# EAGLE design PecanPico5a (EAGLE 6.4)
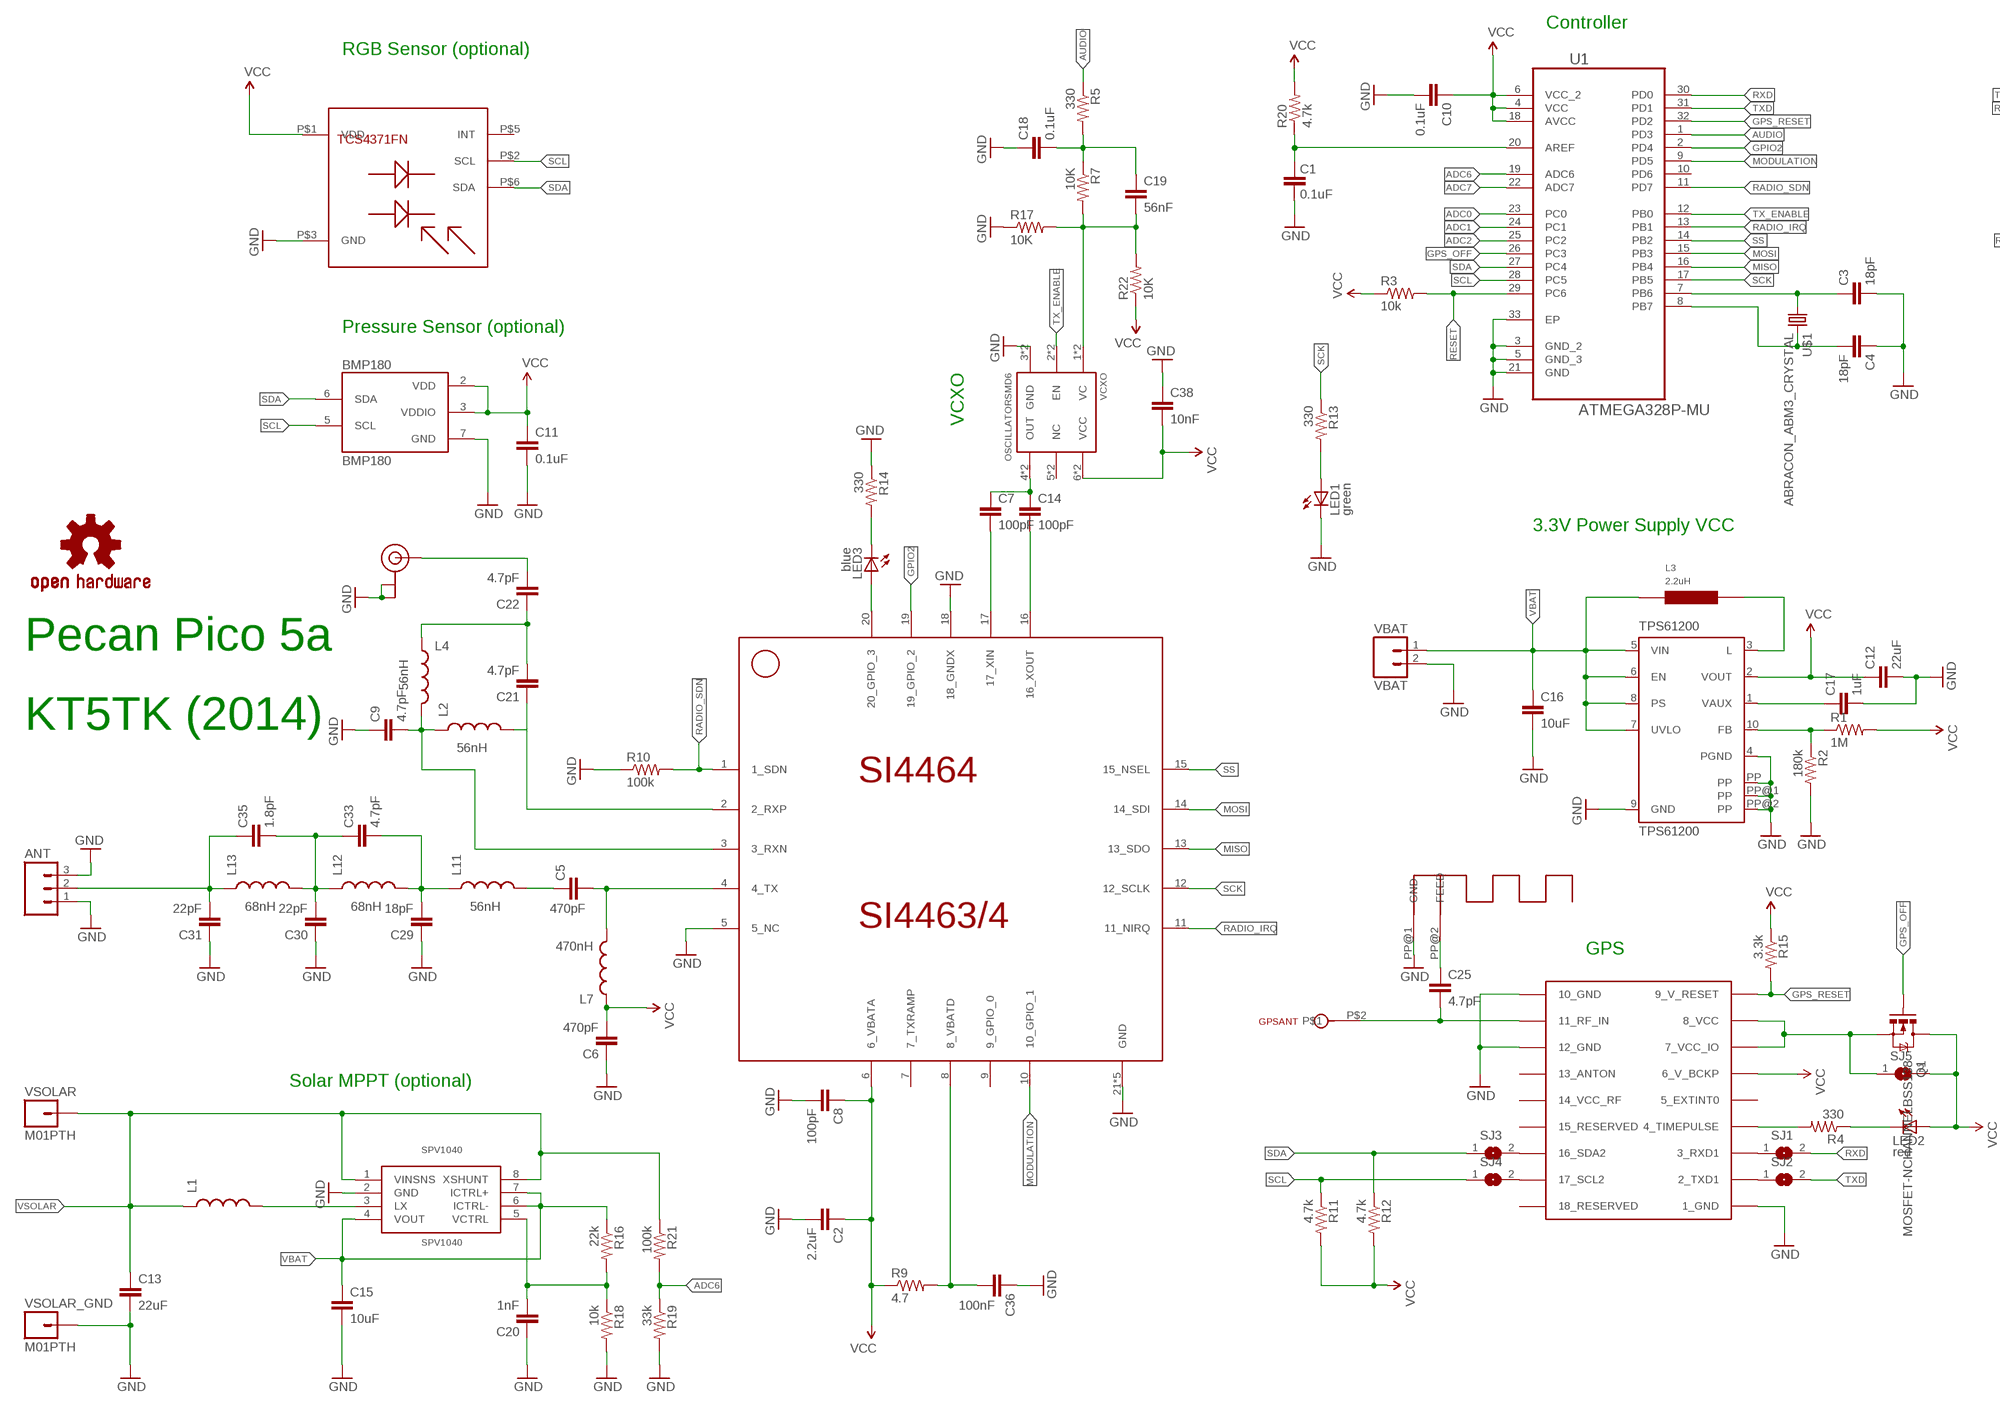
[diagram p0: schematic, sheet 1, part 1 of 2]
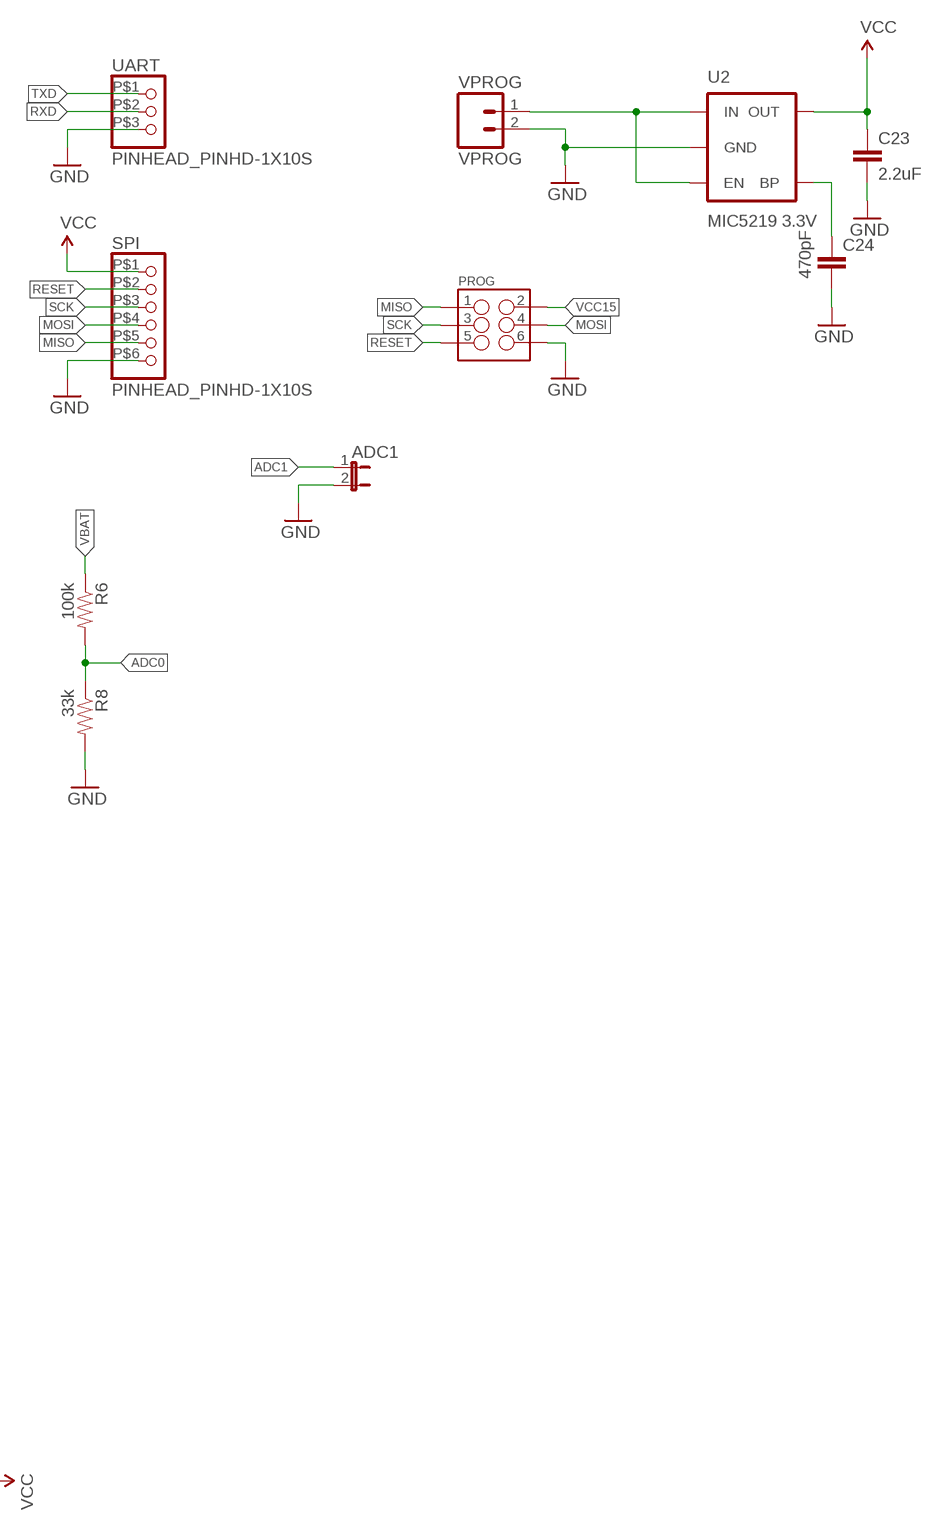
[diagram p1: schematic, sheet 1, part 2 of 2]

## Parts
ADC1  JUMPER-2SMD-NO-NS  [SJ_2S-NO-NS]
ANT  M03PTH  [1X03]
BMP180  BMP180  [BMP180]
C1  0.1uF  CAP0402-CAP  [0402-CAP]
C2  2.2uF  CAP0603-CAP  [0603-CAP]
C3  18pF  CAP0402-CAP  [0402-CAP]
C4  18pF  CAP0402-CAP  [0402-CAP]
C5  470pF  CAP0402-CAP  [0402-CAP]
C6  470pF  CAP0402-CAP  [0402-CAP]
C7  100pF  CAP0402-CAP  [0402-CAP]
C8  100pF  CAP0402-CAP  [0402-CAP]
C9  4.7pF  CAP0402-CAP  [0402-CAP]
C10  0.1uF  CAP0402-CAP  [0402-CAP]
C11  0.1uF  CAP0402-CAP  [0402-CAP]
C12  22uF  CAP0805  [0805]
C13  22uF  CAP0805  [0805]
C14  100pF  CAP0402-CAP  [0402-CAP]
C15  10uF  CAP0805  [0805]
C16  10uF  CAP0805  [0805]
C17  1uF  CAP0805  [0805]
C18  0.1uF  CAP0402-CAP  [0402-CAP]
C19  56nF  CAP0402-CAP  [0402-CAP]
C20  1nF  CAP0402-CAP  [0402-CAP]
C21  4.7pF  CAP0402-CAP  [0402-CAP]
C22  4.7pF  CAP0402-CAP  [0402-CAP]
C23  2.2uF  CAP0603-CAP  [0603-CAP]
C24  470pF  CAP0402-CAP  [0402-CAP]
C25  4.7pF  CAP0402-CAP  [0402-CAP]
C29  18pF  CAP0402-CAP  [0402-CAP]
C30  22pF  CAP0402-CAP  [0402-CAP]
C31  22pF  CAP0402-CAP  [0402-CAP]
C33  4.7pF  CAP0402-CAP  [0402-CAP]
C35  1.8pF  CAP0402-CAP  [0402-CAP]
C36  100nF  CAP0402-CAP  [0402-CAP]
C38  10nF  CAP0402-CAP  [0402-CAP]
GPSANT  1X1S  [1_27X1_PINHEAD_1X10S]
L1  SPARKFUN_INDUCTOR1007  [SPARKFUN_1007]
L2  56nH  INDUCTOR0603  [0603]
L3  2.2uH  LPS3015  [LPS3015]
L4  56nH  INDUCTOR0603  [0603]
L7  470nH  INDUCTOR0603  [0603]
L11  56nH  INDUCTOR0603  [0603]
L12  68nH  INDUCTOR0603  [0603]
L13  68nH  INDUCTOR0603  [0603]
LED1  green  LED0603  [LED-0603]
LED2  red  LED0603  [LED-0603]
LED3  blue  LED0603  [LED-0603]
LOGO1  OSHW-LOGOS  [OSHW-LOGO-S]
PROG  M03X22X3_SILK_SM  [2X3]
Q1  MOSFET-NCHANNELBSS138  [SOT23]
R1  1M  RESISTOR0402-RES  [0402-RES]
R2  180k  RESISTOR0402-RES  [0402-RES]
R3  10k  RESISTOR0402-RES  [0402-RES]
R4  330  RESISTOR0402-RES  [0402-RES]
R5  330  RESISTOR0402-RES  [0402-RES]
R6  100k  RESISTOR0402-RES  [0402-RES]
R7  10K  RESISTOR0402-RES  [0402-RES]
R8  33k  RESISTOR0402-RES  [0402-RES]
R9  4.7  RESISTOR0402-RES  [0402-RES]
R10  100k  RESISTOR0402-RES  [0402-RES]
R11  4.7k  RESISTOR0402-RES  [0402-RES]
R12  4.7k  RESISTOR0402-RES  [0402-RES]
R13  330  RESISTOR0402-RES  [0402-RES]
R14  330  RESISTOR0402-RES  [0402-RES]
R15  3.3k  RESISTOR0402-RES  [0402-RES]
R16  22k  RESISTOR0402-RES  [0402-RES]
R17  10K  RESISTOR0402-RES  [0402-RES]
R18  10k  RESISTOR0402-RES  [0402-RES]
R19  33k  RESISTOR0402-RES  [0402-RES]
R20  4.7k  RESISTOR0402-RES  [0402-RES]
R21  100k  RESISTOR0402-RES  [0402-RES]
R22  10K  RESISTOR0402-RES  [0402-RES]
SI4464  SI4463/4  [QFN-20]
SJ1  SJ  [SJ]
SJ2  SJ  [SJ]
SJ3  SJ  [SJ]
SJ4  SJ  [SJ]
SJ5  SJ  [SJ]
SPI  PINHEAD_PINHD-1X10S  [PINHEAD_1X10S]
SPV1040  SPV1040  [TSSOP8]
TCS4371FN  TCS4371FN  [TCS3471FN]
TPS61200  TPS61200  [S-PDSO-N10]
U1  ATMEGA328P-MU  [QFN50P500X500X100-33N]
U2  MIC5219 3.3V  V_REG_MIC52193.3V  [SOT23-5]
U$1  ABRACON_ABM3_CRYSTAL  [ABRACON_ABM3_CRYSTAL]
U$2  U.FL  [U.FL]
U$3  UBLOX_MAX-6  [UBLOX_MAX-6]
U$4  GPS_MEANDER  [GPS_INV_F_MEANDER]
UART  PINHEAD_PINHD-1X10S  [PINHEAD_1X10S]
VBAT  VBAT  M02PTH  [1X02]
VCXO  OSCILLATORSMD6  [CRYSTAL-SMD-7.5X5.2-6PIN]
VPROG  VPROG  M02PTH  [1X02]
VSOLAR  M01PTH  [1X01]
VSOLAR_GND  M01PTH  [1X01]

## Nets
ADC0: R6.2 R8.1 U1.23(PC0)
ADC1: ADC1.1 U1.24(PC1)
ADC2: U1.25(PC2)
ADC6: R19.1 R21.2 U1.19(ADC6)
ADC7: U1.22(ADC7)
AREF: C1.2 R20.1 U1.20(AREF)
AUDIO: R5.1 U1.1(PD3)
GND: ADC1.2 ANT.1 ANT.3 BMP180.7(GND) C1.1 C2.2 C3.2 C4.1 C6.1 C8.2 C9.1 C10.2 C11.2 C12.2 C13.2 C15.2 C16.2 C17.2 C18.1 C20.1 C23.2 C24.2 C29.1 C30.1 C31.1 C36.1 C38.1 LED1.C PROG.6 R2.2 R8.2 R10.1 R14.1 R17.1 R18.2 R19.2 SI4464.5(5_NC) SI4464.18(18_GNDX) SI4464.21(GND) SI4464.22(GND) SI4464.23(GND) SI4464.24(GND) SI4464.25(GND) SPI.P$6 SPV1040.2(GND) TCS4371FN.P$3(GND) TPS61200.4(PGND) TPS61200.9(GND) TPS61200.PP TPS61200.PP@1(PP) TPS61200.PP@2(PP) U1.3(GND_2) U1.5(GND_3) U1.21(GND) U1.33(EP) U2.2(GND) U$2.P$1(GND) U$2.P$2(GND) U$3.1_GND U$3.10_GND U$3.12_GND U$4.PP@1(GND) UART.P$3 VBAT.2 VCXO.3(GND) VCXO.3INNER(GND) VPROG.2 VSOLAR_GND.1
GPIO2: SI4464.19(19_GPIO_2) U1.2(PD4)
GPS_OFF: Q1.1(G) U1.26(PC3)
GPS_RESET: R15.2 U1.32(PD2) U$3.9_V_RESET
MISO: PROG.1 SI4464.13(13_SDO) SPI.P$5 U1.16(PB4)
MOD1: C18.2 C19.1 R5.2 R7.1
MODULATION: SI4464.10(10_GPIO_1) U1.9(PD5)
MOSI: PROG.4 SI4464.14(14_SDI) SPI.P$4 U1.15(PB3)
N$2: C14.2 SI4464.16(16_XOUT)
N$3: C25.2 GPSANT.P$2 U$3.11_RF_IN
N$4: L3.P$2 TPS61200.3(L)
N$5: R1.1 R2.1 TPS61200.10(FB)
N$6: LED2.C R4.1
N$7: C17.1 TPS61200.1(VAUX)
N$8: R4.2 U$3.4_TIMEPULSE
N$9: C3.1 U1.7(PB6) U$1.P$1
N$10: C4.2 U1.8(PB7) U$1.P$2
N$13: C7.1 C14.1 VCXO.4(OUT) VCXO.4INNER(OUT)
N$15: SJ1.1 U$3.3_RXD1
N$20: SJ2.1 U$3.2_TXD1
N$21: C19.2 R7.2 R17.2 R22.2 VCXO.1(VC) VCXO.1INNER(VC)
N$22: LED1.A R13.2
N$23: C5.2 L7.2 SI4464.4(4_TX)
N$24: C21.1 L2.2 SI4464.2(2_RXP)
N$25: SJ3.2 U$3.16_SDA2
N$26: SJ4.2 U$3.17_SCL2
N$27: C5.1 L11.2
N$28: C30.2 C33.1 C35.2 L12.1 L13.2
N$29: LED3.A SI4464.20(20_GPIO_3)
N$30: LED3.C R14.2
N$31: C7.2 SI4464.17(17_XIN)
N$32: L1.2 SPV1040.3(LX)
N$33: C9.2 L2.1 L4.2 SI4464.3(3_RXN)
N$34: C29.2 C33.2 L11.1 L12.2
N$35: ANT.2 C31.2 C35.1 L13.1
N$36: C20.2 R16.2 R18.1 SPV1040.5(VCTRL)
N$37: C21.2 C22.1 L4.1
N$38: Q1.2(S) SJ5.1 U$3.7_VCC_IO U$3.8_VCC
N$39: C22.2 U$2.P$3(SIGNAL)
N$40: U2.1(IN) U2.3(EN) VPROG.1
N$41: C36.2 R9.2 SI4464.8(8_VBATD)
N$42: C24.1 U2.4(BP)
N$43: C25.1 U$4.PP@2(FEED)
RADIO_IRQ: SI4464.11(11_NIRQ) U1.13(PB1)
RADIO_SDN: R10.2 SI4464.1(1_SDN) U1.11(PD7)
RESET: PROG.5 R3.2 SPI.P$2 U1.29(PC6)
RXD: SJ1.2 U1.30(PD0) UART.P$2
SCK: PROG.3 R13.1 SI4464.12(12_SCLK) SPI.P$3 U1.17(PB5)
SCL: BMP180.5(SCL) R11.1 SJ4.1 TCS4371FN.P$2(SCL) U1.28(PC5)
SDA: BMP180.6(SDA) R12.1 SJ3.1 TCS4371FN.P$6(SDA) U1.27(PC4)
SS: SI4464.15(15_NSEL) U1.14(PB2)
TX_ENABLE: U1.12(PB0) VCXO.2(EN) VCXO.2INNER(EN)
TXD: SJ2.2 U1.31(PD1) UART.P$1
VBAT [vcc]: C15.1 C16.1 L3.P$1 R6.1 R16.1 SPV1040.4(VOUT) SPV1040.6(ICTRL-) SPV1040.7(ICTRL+) TPS61200.5(VIN) TPS61200.6(EN) TPS61200.7(UVLO) TPS61200.8(PS) VBAT.1
VCC15: BMP180.2(VDD) BMP180.3(VDDIO) C2.1 C6.2 C8.1 C10.1 C11.1 C12.1 C23.1 C38.2 L7.1 LED2.A PROG.2 Q1.3(D) R1.2 R3.1 R9.1 R11.2 R12.2 R15.1 R20.2 R22.1 SI4464.6(6_VBATA) SJ5.2 SPI.P$1 TCS4371FN.P$1(VDD) TPS61200.2(VOUT) U1.4(VCC) U1.6(VCC_2) U1.18(AVCC) U2.5(OUT) U$3.6_V_BCKP VCXO.6(VCC) VCXO.6INNER(VCC) ; supply symbol labelled VCC
VSOLAR: C13.1 L1.1 R21.1 SPV1040.1(VINSNS) SPV1040.8(XSHUNT) VSOLAR.1
Unconnected: SI4464.7(7_TXRAMP) SI4464.9(9_GPIO_0) TCS4371FN.P$5(INT) U1.10(PD6) U$3.5_EXTINT0 U$3.13_ANTON U$3.14_VCC_RF U$3.15_RESERVED U$3.18_RESERVED VCXO.5(NC) VCXO.5INNER(NC)

## Notes on the sheet
- Controller
- RGB Sensor (optional)
- Pressure Sensor (optional)
- VCXO
- 3.3V Power Supply VCC
- Pecan Pico 5a
- KT5TK (2014)
- GPS
- Solar MPPT (optional)

## Library data of the parts
ADC1 = SparkFun-Passives:JUMPER-2: Jumper Basic 0.1" spaced jumper. Use with breakaway headers.
ANT = SparkFun-Connectors:M03: Header 3 Standard 3-pin 0.1" header. Use with straight break away headers (SKU : PRT-00116), right angle break away headers (PRT-00553), swiss pins (PRT-00743), machine pins (PRT-00117), and female headers (PRT-00115). Molex polarized connector foot print use with SKU : PRT-08232 with associated crimp pins and housings.
BMP180 = SparkFun-Sensors:BMP180: BOSCH BMP180 DIGITAL BAROMETRIC PRESSURE SENSOR Web page: http://www.bosch-sensortec.com/en/homepage/products_3/environmental_sensors_1/bmp180_1/bmp180 Datasheet: http://ae-bst.resource.bosch.com/media/products/dokumente/bmp180/BST-BMP180-DS000-09.pdf The BMP180 is the function compatible successor of the BMP085, a new generation of high precision digital pressure sensors for consumer applications. The ultra-low power, low voltage electronics of the BMP180 is optimized for use in mobile phones, PDAs, GPS navigation devices and outdoor equipment. With a low altitude noise of merely 0.25m at fast conversion time, the BMP180 offers superior performance. The I2C interface allows for easy system integration with a microcontroller. The BMP180 is based on piezo-resistive technology for EMC robustness, high accuracy and linearity as well as long term stability. Key features: - Temperature measurement included - I2C interface - Fully calibrated - Pb-free, halogen-free and RoHS compliant, - MSL 1 Basic specs: Pressure range: 300 to 1100hPa (+9000m to -500m relating to sea level) Supply voltage: 1.8 to 3.6V (VDD), 1.62V to 3.6V (VDDIO) Package: LGA package with metal lid Small footprint: 3.6mm x 3.8mm Super-flat: 0.93mm height Low power: 5μA at 1 sample / sec. in standard mode Low noise: 0.06hPa (0.5m) in ultra low power mode, 0.02hPa (0.17m) advanced resolution mode Typical applications: - Enhancement of GPS navigation (dead-reckoning, slope detection, etc.) - In- and out-door navigation - Leisure and sports - Weather forecast - Vertical velocity indication (rise/sink speed)
C1-C11 C14 C18-C25 C29-C31 C33 C35 C36 C38 = SparkFun:CAP: Capacitor Standard 0603 ceramic capacitor, and 0.1" leaded capacitor.
C12 C13 C15-C17 = SparkFun-Passives:CAP: Capacitor Standard 0603 ceramic capacitor, and 0.1" leaded capacitor.
GPSANT = PecanPico5a:1X1S
L1 = HabAmp.lbrHAMAmp2.1:SPARKFUN_INDUCTOR: Inductors Basic Inductor/Choke - 0603 and 1206. Footprints are not proven and vary greatly between part numbers.
L2 L4 L7 L11-L13 = SparkFun:INDUCTOR: Inductors Basic Inductor/Choke - 0603 and 1206. Footprints are not proven and vary greatly between part numbers.
L3 = inductor-coilcraft-TK:LPS3015: LPS3015 Series Low Profile Shielded Power Inductors http://www.coilcraft.com/lps3015.cfm <0.058>
LED1-LED3 = SparkFun:LED: LEDs Standard schematic elements and footprints for 5mm, 3mm, 1206, and 0603 sized LEDs. 5mm - Spark Fun Electronics SKU : COM-00529 (and others)
LOGO1 = SparkFun-Aesthetics:OSHW-LOGO: Open Source Hardware Logo This logo indicates the piece of hardware it is found on incorporates a OSHW license and/or adheres to the definition of open source hardware found here: http://freedomdefined.org/OSHW
PROG = SparkFun-Connectors:M03X2: 2x3 .1" header. Shrouded, with keying- CONN-10681 SMT- CONN-11415 Pogo pins- HW-11044
Q1 = SparkFun-DiscreteSemi:MOSFET-NCHANNEL: Common NMOSFET Parts MFG P/N Store ID Prod ID FDD8780 TRANS-09984 SI7820DN TRANS-11055 FDS6630A IC-08089 2N7002PW TRANS-11151 FQP30N06L COM-10213 TRANS-10060 BSS123LT1G TRANS-08345 BSS138 TRANS-00830 BS170 2N7000; PROD_ID: TRANS-00830
R1-R22 = SparkFun:RESISTOR: Resistor Basic schematic elements and footprints for 0603, 1206, and PTH resistors.
SI4464 = KT5TK:SI4463/4
SJ1-SJ5 = jumper:SJ: SMD solder JUMPER
SPI = 1_27x6:PINHEAD_PINHD-1X10S: Pinhad 1x10 smal
SPV1040 = SPV1040:SPV1040
TCS4371FN = KT5TK:TCS4371FN: TCS4371FN Color Sensor The TCS3471 family of devices provides red, green, blue, and clear light sensing (RGBC) that detects light intensity under a variety of lighting conditions and through a variety of attenuation materials. An internal state machine provides the ability to put the device into a low power mode in between RGBC measurements providing very low average power consumption. The TCS3471 is directly useful in lighting conditions containing minimal IR content such as LED RGB backlight control, reflected LED color sampler, or fluorescent light color temperature detector. With the addition of an IR blocking filter, the device is an excellent ambient light sensor, color temperature monitor, and general purpose color sensor.
TPS61200 = texas:TPS6120*: LOW INPUT VOLTAGE SYNCHRONOUS BOOST CONVERTER WITH 1.3-A SWITCHES Source: http://focus.ti.com/lit/ds/symlink/tps61200.pdf; MPN: TPS61200DRCT; OC_FARNELL: 1471238; OC_NEWARK: 37M0066
U1 = ava:ATMEGA328P-MU: Programmable Flash; MPN: ATMEGA328P-MU; OC_FARNELL: 1748522; OC_NEWARK: 26R2526; PACKAGE: QFN-32; SUPPLIER: Atmel
U2 = SparkFun-PowerIC:V_REG_MIC5219: V_REG MIC5219 Standard 500mA LDO voltage regulator in SOT-23 layout. Micrel part MIC5219. BP (by-pass) pin is used to lower output noise with 470pF cap, may be left open.; PROD_ID: VREG-09872
U$1 = ava:ABRACON_ABM3_CRYSTAL
U$2 = SparkFun-Connectors:U.FL: SMD antenna connector- WRL-09144
U$3 = ava:UBLOX_MAX-6: UBLOX MAX-6
U$4 = KT5TK:GPS_MEANDER
UART = 1_27x3:PINHEAD_PINHD-1X10S: Pinhad 1x10 smal
VBAT VPROG = SparkFun:M02: Header 2 Standard 2-pin 0.1" header. Use with straight break away headers (SKU : PRT-00116), right angle break away headers (PRT-00553), swiss pins (PRT-00743), machine pins (PRT-00117), and female headers (PRT-00115). Molex polarized connector foot print use with SKU : PRT-08233 with associated crimp pins and housings.
VCXO = SparkFun-FreqCtrl_TK:OSCILLATOR: Generic 5x3 and 7x5 oscillators
VSOLAR VSOLAR_GND = SparkFun-Connectors:M01: Header 1 Standard 1-pin 0.1" header. Use with straight break away headers (SKU : PRT-00116), right angle break away headers (PRT-00553), swiss pins (PRT-00743), machine pins (PRT-00117), and female headers (PRT-00115).

## Net classes
0 default: width 0.203 mm
1 vcc: width 0.254 mm

## Board
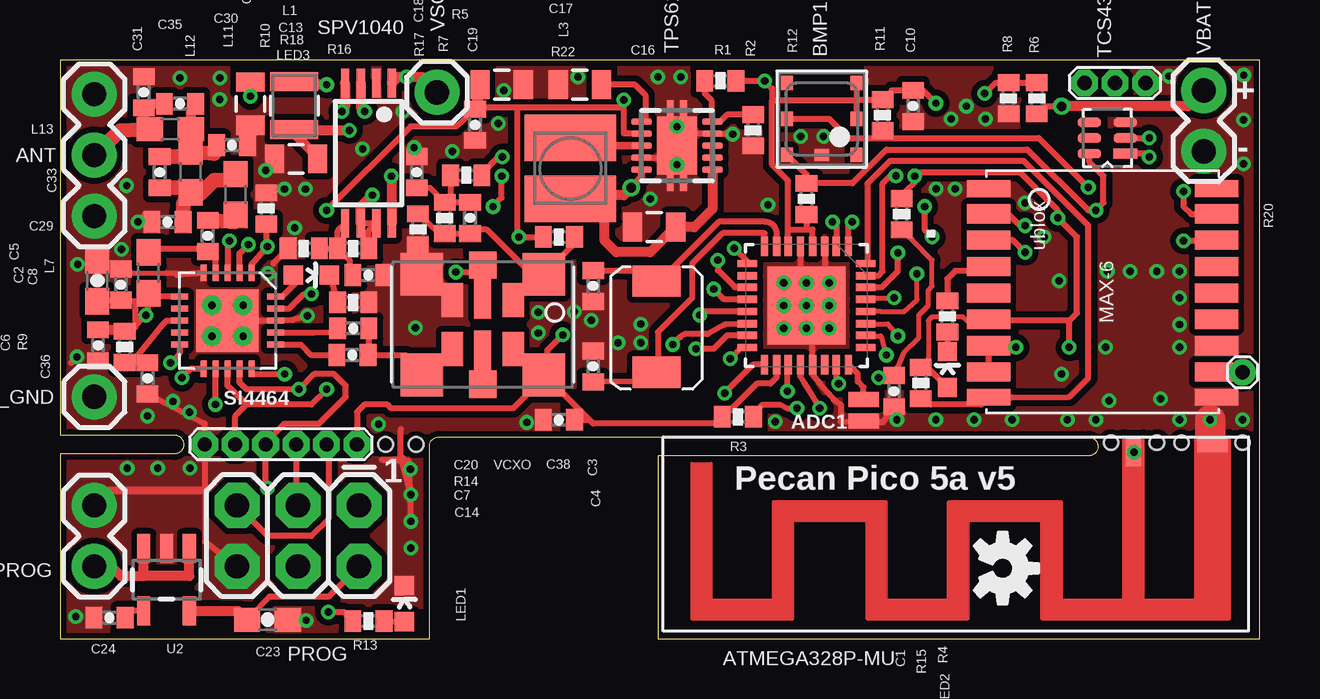
[diagram p2: board, top side]
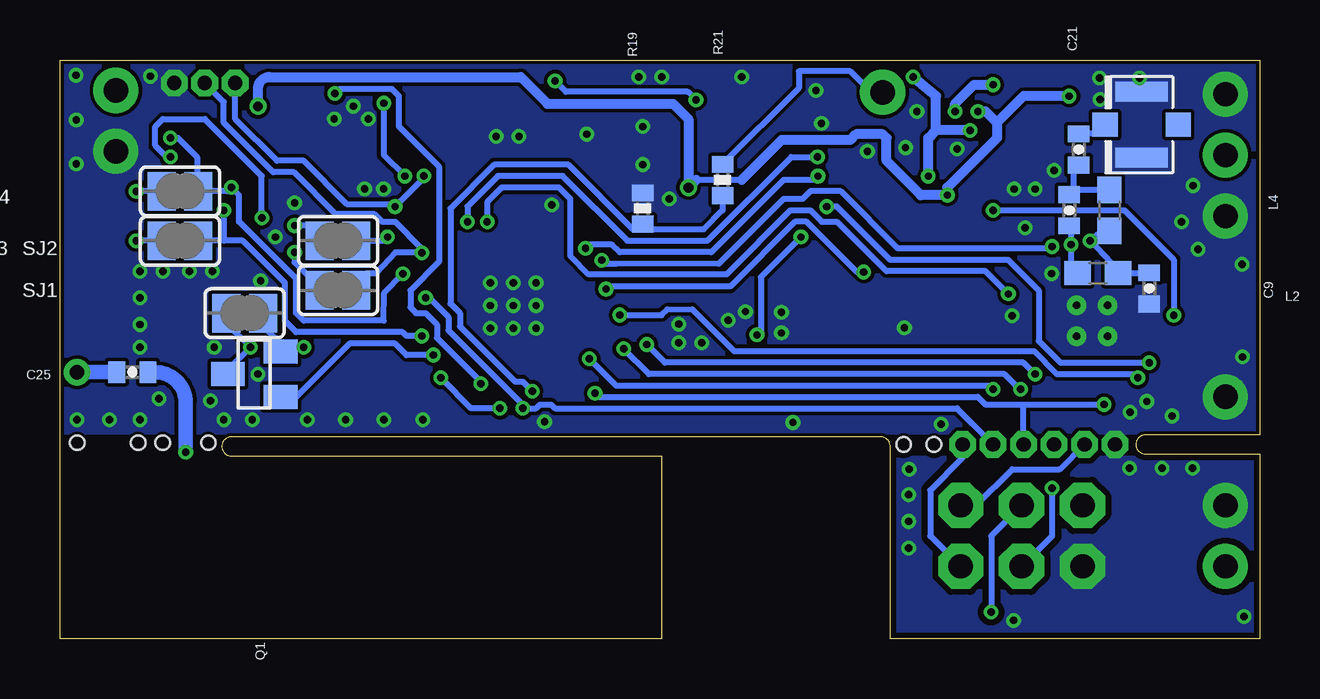
[diagram p3: board, bottom side, seen from below]

Size 50.01 x 24.13 mm. Coordinates in mm from the lower left corner, seen from the top.
Outline: 0,0 15.4,0 15.4,8.02 arc-90 15.8,8.41 42.86,8.41 arc-90 43.26,8.02 arc-100 42.78,7.62 24.92,7.62 24.92,0 50.01,0 50.01,24.13 0,24.13 0,8.49 4.76,8.49 arc-90 5.16,8.1 arc-90 4.76,7.7 0,7.7 0,0
Copper layers (1*16): Top 0.035mm / dielectric 1.5mm / Bottom 0.035mm
Design rules "hackvana *": minimum track width 6mil, minimum drill 0.3mm, track to track 6mil, track to pad 6mil, pad to pad 6mil, via to via 6mil, smd to smd 0mil, copper to edge 6mil, drill to drill 6mil, minimum pad ring 10mil, minimum via ring 6mil, stop-mask expansion 2mil, vias tented up to drill 100mil, thermal gap 10mil
Holes 0.6 mm at 43.81,8.18 45.72,8.18 46.75,8.18 49.29,8.18 13.57,8.1 14.84,8.1

### Footprints (pad centres in the part's own frame; a part is rotated, then mirrored left to right if it is on the bottom)
SJ_2S-NO-NS = smd 0.635 x 1.27: 1 -0.45,0; 2 0.45,0
1X03 = drill 1.016 pad 1.88: 1 0,0; 2 2.54,0; 3 5.08,0
BMP180 = smd 0.6 x 0.5: 1 1.5,1.45; 2 0,1.45; 3 -1.5,1.45; 4 -1.5,-1.45; 5 0,-1.45; 6 1.5,-1.45 | smd 0.5 x 0.6: 7 1.5,0
0402-CAP = smd 0.7 x 0.9: 1 -0.65,0; 2 0.65,0
0603-CAP = smd 1.1 x 1: 1 -0.85,0; 2 0.85,0
0805 = smd 0.8 x 1.2: 1 -0.9,0; 2 0.9,0
1_27X1_PINHEAD_1X10S = drill 0.6 pad 0.914: P$2 0.001,-0.003
SPARKFUN_1007 = smd 2 x 0.8: 1 0,1; 2 0,-1
0603 = smd 1.1 x 1: 1 -0.85,0; 2 0.85,0
LPS3015 = smd 1.93 x 3.81: P$1 -1.27,0; P$2 1.27,0
LED-0603 = smd 0.8 x 0.8: A 0,-0.75; C 0,0.75
2X3 = drill 1.016 pad 1.88 octagon: 1 0,0; 2 0,2.54; 3 2.54,0; 4 2.54,2.54; 5 5.08,0; 6 5.08,2.54
SOT23 = smd 1 x 1.4: 1 -0.95,-1.1; 2 0.95,-1.1; 3 0,1.1
0402-RES = smd 0.7 x 0.9: 1 -0.65,0; 2 0.65,0
QFN-20 = smd 0.7 x 0.25: 1 -2,1; 2 -2,0.5; 3 -2,0; 4 -2,-0.5; 5 -2,-1; 11 2,-1; 12 2,-0.5; 13 2,0; 14 2,0.5; 15 2,1 | smd 0.25 x 0.7: 6 -1,-2; 7 -0.5,-2; 8 0,-2; 9 0.5,-2; 10 1,-2; 16 1,2; 17 0.5,2; 18 0,2; 19 -0.5,2; 20 -1,2 | smd 2.6 x 2.6: 21 0,0 | drill 0.305: 22 -0.65,0.65; 23 0.65,0.65; 24 0.65,-0.65; 25 -0.65,-0.65
SJ = smd 1.168 x 1.6: 1 -0.762,0; 2 0.762,0
PINHEAD_1X10S = drill 0.6 pad 0.914 octagon: P$1 -0.635,5.715; P$2 -0.635,4.445; P$3 -0.635,3.175; P$4 -0.635,1.905; P$5 -0.635,0.635; P$6 -0.635,-0.635
TSSOP8 = smd 1.2 x 0.35: 1 -2.925,0.975; 2 -2.925,0.325; 3 -2.925,-0.325; 4 -2.925,-0.975; 5 2.925,-0.975; 6 2.925,-0.325; 7 2.925,0.325; 8 2.925,0.975
TCS3471FN = smd 1 x 0.4: P$1 -0.75,0.65; P$2 -0.75,0; P$3 -0.75,-0.65; P$4 0.75,-0.65; P$5 0.75,0; P$6 0.75,0.65
S-PDSO-N10 = smd 0.28 x 0.85: 1 -1,-1.475; 2 -0.5,-1.475; 3 0,-1.475; 4 0.5,-1.475; 5 1,-1.475; 6 1,1.475; 7 0.5,1.475; 8 0,1.475; 9 -0.5,1.475; 10 -1,1.475 | smd 2.4 x 1.65: PP 0,0 | smd 3.8 x 0.28: PP@1 0,0.275; PP@2 0,-0.275
QFN50P500X500X100-33N = smd 0.813 x 0.305: 1 -2.464,1.753; 2 -2.464,1.245; 3 -2.464,0.762; 4 -2.464,0.254; 5 -2.464,-0.254; 6 -2.464,-0.762; 7 -2.464,-1.245; 8 -2.464,-1.753; 17 2.464,-1.753; 18 2.464,-1.245; 19 2.464,-0.762; 20 2.464,-0.254; 21 2.464,0.254; 22 2.464,0.762; 23 2.464,1.245; 24 2.464,1.753 | smd 0.305 x 0.813: 9 -1.753,-2.464; 10 -1.245,-2.464; 11 -0.762,-2.464; 12 -0.254,-2.464; 13 0.254,-2.464; 14 0.762,-2.464; 15 1.245,-2.464; 16 1.753,-2.464; 25 1.753,2.464; 26 1.245,2.464; 27 0.762,2.464; 28 0.254,2.464; 29 -0.254,2.464; 30 -0.762,2.464; 31 -1.245,2.464; 32 -1.753,2.464 | smd 3.251 x 3.251: 33 0,0
SOT23-5 = smd 0.55 x 1.2: 1 -0.95,-1.3; 2 0,-1.3; 3 0.95,-1.3; 4 0.95,1.3; 5 -0.95,1.3
ABRACON_ABM3_CRYSTAL = smd 1.3 x 2: P$1 -3.4,0.1; P$2 0.4,0.1
U.FL = smd 2.2 x 0.85: P$1 0,1.375; P$2 0,-1.375 | smd 1.05 x 1: P$3 1.525,0; P$4 -1.525,0
UBLOX_MAX-6 = smd 1.8 x 0.7: 1_GND 4.95,-4.4; 9_V_RESET 4.95,4.3; 10_GND -4.55,4.3; 18_RESERVED -4.55,-4.4 | smd 1.8 x 0.8: 2_TXD1 4.95,-3.35; 3_RXD1 4.95,-2.25; 4_TIMEPULSE 4.95,-1.15; 5_EXTINT0 4.95,-0.05; 6_V_BCKP 4.95,1.05; 7_VCC_IO 4.95,2.15; 8_VCC 4.95,3.25; 11_RF_IN -4.55,3.25; 12_GND -4.55,2.15; 13_ANTON -4.55,1.05; 14_VCC_RF -4.55,-0.05; 15_RESERVED -4.55,-1.15; 16_SDA2 -4.55,-2.25; 17_SCL2 -4.55,-3.35
GPS_INV_F_MEANDER = smd 1.27 x 0.635: PP@1 0.7,0.3 | smd 0.635 x 1.27: PP@2 4,0.6
PINHEAD_1X10S' = drill 0.6 pad 0.914 octagon: P$1 -0.635,5.715; P$2 -0.635,4.445; P$3 -0.635,3.175
1X02 = drill 1.016 pad 1.88: 1 0,0; 2 2.54,0
CRYSTAL-SMD-7.5X5.2-6PIN = smd 1.778 x 1.778: 1 -2.54,-2.1; 3 2.54,-2.1; 4 2.54,2.1; 6 -2.54,2.1 | smd 0.889 x 1.422: 1INNER -1.27,-1.016; 3INNER 1.27,-1.016; 4INNER 1.27,1.016; 6INNER -1.27,1.016 | smd 1.143 x 1.143: 2 0,-2.481; 5 0,2.481 | smd 0.711 x 1.778: 2INNER 0,-1.143; 5INNER 0,1.143
1X01 = drill 1.016 pad 1.88: 1 0,0

### Placement (x,y rotation side)
ADC1  33.5,9.53 270 top
ANT  1.43,17.62 90 top
BMP180  31.75,21.67 270 top
C1  34.77,10.32 90 top
C2  1.56,14.92 90 top
C3  22.23,14.7 270 top
C4  22.23,11.35 270 top
C5  6.16,16.8 270 top
C6  1.59,12.23 90 top
C7  12.22,12.94 180 top
C8  2.54,14.76 90 top
C9  4.6,14.61 90 bottom
C10  35.56,22.21 270 top
C11  17.3,21.43 270 top
C12  18.41,23.1 0 top
C13  9.84,20 180 top
C14  12.19,11.83 180 top
C15  7.94,22.3 270 top
C16  24.77,17.16 180 top
C17  21.67,23.1 180 top
C18  14.87,19.45 270 top
C19  17.09,17.54 270 top
C20  12.86,15.16 180 top
C21  7.94,17.86 90 bottom
C22  7.54,20.4 90 bottom
C23  8.65,0.79 0 top
C24  2.06,0.87 180 top
C25  46.99,11.11 180 bottom
C29  4.49,17.37 0 top
C30  7.18,20.58 180 top
C31  3.49,22.78 270 top
C33  4.16,19.45 270 top
C35  5,22.3 0 top
C36  3.65,10.86 90 top
C38  20.8,9.13 0 top
GPSANT  49.29,11.11 0 top
L1  9.76,22.23 180 top
L2  6.75,15.24 180 bottom
L3  21.27,19.61 90 top
L4  6.27,17.86 270 bottom
L7  3.7,15.26 90 top
L11  7.32,18.52 270 top
L12  5.44,19.46 270 top
L13  4.6,21.24 0 top
LED1  14.35,1.47 0 top
LED2  36.99,11.22 0 top
LED3  10.48,15.16 270 top
LOGO1  39.29,2.94 270 top
PROG  12.46,5.56 180 top
Q1  41.91,11.03 90 bottom
R1  27.53,23.26 0 top
R2  28.89,21.19 270 top
R3  28.26,9.25 0 top
R4  36.99,13.44 90 top
R5  16.94,19.32 180 top
R6  40.72,22.53 90 top
R7  16.03,17.54 270 top
R8  39.54,22.53 270 top
R9  2.7,12.16 270 top
R10  8.6,17.94 270 top
R11  34.29,21.83 90 top
R12  31.11,18.34 270 top
R13  12.86,0.73 0 top
R14  12.22,14.02 180 top
R15  35.88,10.66 270 top
R16  12.22,16.27 180 top
R17  14.92,17.07 90 top
R18  10.16,16.27 180 top
R19  25.72,17.94 90 bottom
R20  35.08,17.7 90 top
R21  22.38,19.13 270 bottom
R22  20.8,16.75 0 top
SI4464  6.99,13.26 270 top
SJ1  38.42,14.53 0 bottom
SJ2  38.42,16.59 0 bottom
SJ3  45,16.59 180 bottom
SJ4  45,18.65 180 bottom
SJ5  42.31,13.57 180 bottom
SPI  6.67,7.46 270 top
SPV1040  12.86,20.24 270 top
TCS4371FN  43.66,20.88 180 top
TPS61200  25.72,20.56 270 top
U1  31.11,13.89 270 top
U2  4.45,2.46 180 top
U$1  24.77,11.51 270 top
U$2  4.92,21.43 180 bottom
U$3  43.66,14.37 180 top
U$4  48.74,8.41 180 top
UART  PINHEAD_PINHD-1X10S  [PINHEAD_1X10S']  48.42,23.8 90 top
VBAT  47.68,22.86 270 top
VCXO  17.62,13.1 180 top
VPROG  1.43,3.02 90 top
VSOLAR  15.72,22.78 0 top
VSOLAR_GND  1.43,10.08 0 top

### Tracks (layer width: path | path; a pad name or v marks a point on that pad's centre or on a via)
ADC0  (via drill 0.3)
  Top 0.254: v32.46,10.64 32.36,10.77 U1.23 | v38.54,22.73 38.99,23.18 R8.1 R6.2
  Bottom 0.254: v32.46,10.64 32.54,10.79 34.29,12.54 34.29,13.1 34.77,13.57 35.16,13.57 35.4,13.81 35.4,14.53 34.21,15.72 34.21,19.68 35.88,21.35 35.88,22.62 36.17,22.91 38.36,22.91 v38.54,22.73
ADC1
  Top 0.254: 32.89,11.41 U1.24 33.26,11.04 33.26,10.72 33.5,10.48 ADC1.1
ADC6  (via drill 0.3)
  Top 0.254: v30.32,10.32 30.32,11.39 U1.19
  Bottom 0.254: R21.2 22.38,17.86 23.18,17.07 25.72,17.07 | 25.72,17.07 R19.1 | 25.72,17.07 26.11,17.07 28.81,19.76 31.91,19.76 33.73,17.94 33.73,13.97 33.34,13.57 33.34,13.02 31.04,10.72 30.72,10.72 v30.32,10.32
AREF  (via drill 0.3)
  Top 0.203: R20.1 35.56,16.59 36.35,15.8 36.35,14.68 36.2,14.53 36.2,13.89 35.8,13.49 35.8,12.54 35.16,11.91 34.92,11.35 34.77,11.19
  Top 0.254: U1.20 30.86,10.94 31.04,10.64 v31.67,9.6 | 34.77,11.19 C1.2 34.43,10.87 v34.13,10.87
  Bottom 0.254: v31.67,9.6 32.86,9.6 v34.13,10.87
AUDIO  (via drill 0.3)
  Top 0.254: U1.1 32.87,17.23 v33.02,17.38 | v18.43,20.09 v18.43,20.08 18.26,20.08 17.97,19.8 R5.1
  Bottom 0.254: v33.02,17.38 33.02,18.02 31.75,19.29 29.05,19.29 26.35,16.59 23.02,16.59 19.52,20.09 v18.43,20.09
GND  (via drill 0.3)
  Top 0.203: 2.7,15.16 2.86,15.24 4.92,15.24 4.87,15.18 | 6.03,6.19 6.03,4.05
  Top 0.254: 0.46,11.51 0.48,11.51 | 25.98,20.72 TPS61200.PP | TPS61200.PP TPS61200.PP@2 25.44,20.06 TPS61200.4 | 25.99,21.06 TPS61200.9 27.74,21.06 | 25.99,21.06 TPS61200.PP@1 TPS61200.PP | 15.08,15.8 VCXO.3 15.27,15.2 VCXO.3INNER | 31.37,13.89 U1.21 31.35,11.03 31.67,10.64 32.31,9.92 32.23,10 32.54,9.76 32.54,9.05 34.13,9.03 | U1.5 30.86,13.89 U1.33 31.37,13.89 | U1.3 31.88,13.89 31.37,13.89 | v25.72,21.35 25.72,21.33 arc90 25.99,21.06 | v25.72,19.76 arc90 25.4,20.08 | SI4464.22 7.63,13.26 SI4464.18 9.68,13.28 v10.31,13.46 | C8.2 2.68,15.33 2.86,15.24 | 4.87,15.18 SI4464.5 | 34.13,9.03 34.31,9.03 C1.1 | C36.1 6,8.97 6.03,8.97 SPI.P$6 6.03,6.19 | 6.03,4.05 PROG.6 | ADC1.2 34.09,9.07 34.13,9.03 | 8.89,15.64 9.29,16.03 | v14.63,4.89 14.55,7.4 | 14.55,7.4 13.41,7.46 | v14.63,6 14.23,7.48 | 14.23,7.48 14.21,7.46 13.46,7.46 14.55,7.4 | 14.21,8.73 14.21,7.54 14.29,7.54 14.23,7.48
  Top 0.305: VPROG.2 2.06,6.19 6.03,6.19
  Top 0.61: C29.1 3.65,17.56 | U$4.PP@1 47.94,8.11
  Top 1.27: 47.94,8.11 v47.94,9.13
  other vias: 8.57,19.52 18.49,22.86 29.51,18.09 31.11,13.89 30.16,14.84 31.11,14.84 32.07,14.84 32.07,13.89 32.07,12.94 31.11,12.94 30.16,12.94 30.16,13.89 30.87,20.94 23.26,12.34 18.27,21.49 2.57,16.23 19.93,13.61 19.93,12.75 5,23.38 2.78,18.89 0.71,11.75 3.65,9.29 5.4,9.45 14.81,12.96 0.74,15.61 3.25,17.38 14.29,21.99 6.66,22.48 12.61,20.42 9.36,18.75 10.23,18.75 49.34,23.5 41.02,16.75 46.67,12.14 46.67,13.1 46.67,14.21 46.67,15.32 25.88,23.42 24.92,23.42 38.1,9.13 39.69,9.13 45.88,10 46.67,9.13 14.61,7.06 41.64,14.92 36.51,9.13 41.99,9.13 9.78,17.14 22.15,13.27 24.21,13.12 24.21,12.34 21.43,13.64 28.04,21.03 40.23,18.18 43.74,9.92 43.58,12.14 49.29,9.13 43.18,9.13 45.72,15.32 44.61,15.32 43.66,15.32 37.78,22.2 37.15,21.67 38.58,21.67 36.52,18.75 37.31,18.75 31.83,20.94 49.33,19.8 49.33,21.63 46.23,23.45 34.89,9.13 24.61,18.34 8.67,15.22 19.46,9.02 4.71,9.89 14.76,20.48 16.35,20.32 41.75,11.03 21.59,23.42 29.81,9.05 6.67,23.38 10.26,0.76 5.42,7.11 0.66,0.92 2.8,7.11 4.07,7.11 14.63,3.78 13.28,8.94
  pour Top (isolate 0.254, no thermals): 49.93,24.05 0.16,24.05 0.16,8.64 49.93,8.64 49.93,23.92 49.96,24
  pour Bottom (no thermals): 0.08,24.05 49.93,24.05 49.96,24 49.93,24 49.93,8.64 0.16,8.64 0.16,22.3 0.08,22.3
  pour Bottom (isolate 0.254, no thermals): 0,0 0,7.49 15.08,7.49 15.08,0.08
  pour Top (isolate 0.254, no thermals): 0,0 0,7.49 15.11,7.49 15.08,0.08
GPIO2  (via drill 0.3)
  Top 0.254: 32.38,16.38 U1.2 32.36,17.22 v32.2,17.38 | v10.48,14.37 10.16,14.37 9.55,13.76 SI4464.19
  Bottom 0.254: v10.48,14.37 11.42,15.32 15.56,15.32 17.62,17.38 18.26,17.38 18.73,17.86 19.56,17.86 22.23,15.19 27.97,15.19 28.73,15.95 28.73,18.34 29.21,18.81 31.59,18.81 32.2,18.2 v32.2,17.38
GPS_OFF  (via drill 0.3)
  Top 0.203: U1.26 33.95,12.65 33.89,12.62 34.21,12.62 34.29,12.38 34.37,12.06 v34.45,11.83
  Bottom 0.254: v34.45,11.83 35.56,11.83 36.04,12.3 37.94,12.3 40.16,10.08 Q1.1
GPS_RESET
  Top 0.254: R15.2 36.28,9.76 38.4,9.76 U$3.9_V_RESET 39.67,10.07 42.07,10.08 42.86,10.87 42.86,17.22 40.16,19.92 34.61,19.92 33.66,18.97 33.66,15.72 U1.32
MISO  (via drill 0.3)
  Top 0.254: U1.16 28.41,12.14 v27.94,11.67 | v11.11,10.4 10.48,9.76 7.78,9.76 | 7.78,9.76 6.99,10.56 SI4464.13 | SPI.P$5 7.31,9.29 7.78,9.76
  Bottom 0.254: v27.94,11.67 26.83,10.56 11.27,10.56 v11.11,10.4 | PROG.1 11.83,5.56 10.32,7.06 8.34,7.06 SPI.P$5
MOD1
  Top 0.254: C19.1 R7.1 | R5.2 16.29,18.27 R7.1 | C18.2 15.43,18.8 R7.1
MODULATION  (via drill 0.3)
  Top 0.254: v18.41,19.29 18.41,18.38 v18.05,18.02 | v28.1,16.27 28.65,15.72 U1.9 | SI4464.10 4.99,11.89 v4.6,11.51
  Bottom 0.254: v18.05,18.02 17.62,18.02 15.4,15.8 10.48,15.8 9.21,14.53 9.21,12.42 8.3,11.51 v4.6,11.51 | v18.41,19.29 18.57,19.13 19.84,19.13 22.86,16.11 26.67,16.11 26.99,16.43 27.94,16.43 v28.1,16.27
MOSI  (via drill 0.3)
  Top 0.254: SI4464.14 7.49,10.69 7.78,10.4 v9.96,10.4 10.6,11.03 11.43,11.03 11.91,10.56 11.91,10.08 10.79,8.97 9.37,8.97 8.57,8.18 SPI.P$4 8.57,6.35 v8.65,6.27 | U1.15 27.81,12.65 27.25,12.09 v26.51,12.09
  Bottom 0.254: v9.96,10.4 10,10.4 10.64,11.03 25.46,11.03 v26.51,12.09 | PROG.4 8.65,4.29 v8.65,6.27
N$2
  Top 0.254: SI4464.16 10.05,12.26 10.48,11.83 C14.2
N$3
  Top 0.406: U$3.11_RF_IN GPSANT.P$2
  Bottom 0.254: 49.21,11.11 GPSANT.P$2
  Bottom 0.61: C25.2 49.21,11.11
N$4
  Top 0.305: TPS61200.3 21.91,20.56 L3.P$2
N$5
  Top 0.254: R1.1 26.88,22.73 27.15,22.46 27.15,21.6 TPS61200.10 27.51,21.56 27.8,21.84 R2.1
N$6
  Top 0.254: R4.1 LED2.C
N$7
  Top 0.254: C17.1 23.97,23.1 24.4,22.67 24.4,21.56 TPS61200.1
N$8
  Top 0.254: U$3.4_TIMEPULSE 38.52,15.33 37.32,15.33 36.99,15 R4.2
N$9
  Top 0.254: C3.1 24.86,15.35 U$1.P$1 24.99,14.91 27.46,17.38 29.39,17.38 arc-90 29.87,16.91 U1.7
N$10
  Top 0.254: U1.8 29.36,16.59 29.37,16.91 27.62,16.91 26.35,15.64 26.35,14.21 24.92,12.78 24.92,11.17 U$1.P$2 24.52,11.11 24.13,10.72 C4.2
  Top 0.305: 25.08,11.11 U$1.P$2
N$13
  Top 0.254: VCXO.4 15.27,11 VCXO.4INNER | 14.5,10.41 VCXO.4 | VCXO.4 14.41,11.83 C14.1 12.87,12.18 C7.1
N$15  (via drill 0.3)
  Top 0.254: 38.73,16.59 U$3.3_RXD1 39.72,16.62 v40.23,16.11
  Bottom 0.254: v40.23,16.11 40.23,15.7 39.18,14.65 SJ1.1
N$20  (via drill 0.3)
  Top 0.254: U$3.2_TXD1 38.72,17.7 39.53,17.7 40.01,17.22 v40.23,17.22
  Bottom 0.254: SJ2.1 39.5,17.22 v40.23,17.22
N$21
  Top 0.254: VCXO.1 VCXO.1INNER | VCXO.1 19.65,15.2 17.8,17.05 17.09,17.05 C19.2 R7.2 15.76,16.92 R17.2 | R22.2 21.45,16.48 VCXO.1
N$22
  Top 0.254: R13.2 13.59,0.73 LED1.A
N$23
  Top 0.254: SI4464.4 6.49,15.8 C5.2 5.95,16.27 5.71,16.27 3.81,16.27 3.7,16.16 L7.2
  Top 0.61: 5.96,16.22 C5.2
N$24  (via drill 0.3)
  Top 0.254: SI4464.2 7.49,16.06 v7.86,16.43
  Bottom 0.254: L2.2 7.86,15.5 v7.86,16.43 7.86,16.99 7.94,17.07 C21.1
N$25  (via drill 0.3)
  Top 0.254: v46.83,16.59 48.18,16.59 U$3.16_SDA2
  Bottom 0.254: SJ3.2 v46.83,16.59
N$26  (via drill 0.3)
  Top 0.254: v46.83,18.65 46.83,18.02 47.15,17.7 48.19,17.7 U$3.17_SCL2
  Bottom 0.254: SJ4.2 v46.83,18.65
N$27
  Top 0.61: C5.1 7.29,17.36 L11.2
N$28
  Top 0.406: C30.2 6.42,20.23 | C35.2 5.45,22.1 L13.2
  Top 0.61: L13.2 L12.1 | L12.1 4.88,20.1 C33.1 | 6.42,20.23 L12.1
N$29
  Top 0.254: SI4464.20 9.26,14.26 9.84,14.84 9.84,14.96 LED3.A
N$30
  Top 0.254: LED3.C R14.2
N$31
  Top 0.254: SI4464.17 10.61,12.76 11.43,12.78 C7.2
N$32  (via drill 0.3)
  Top 0.406: SPV1040.3 12.53,22.15 v12.7,21.99 | v11.11,23.1 10.58,23.1 L1.2
  Bottom 0.406: v12.7,21.99 12.7,22.3 11.91,23.1 v11.11,23.1
N$33  (via drill 0.3)
  Top 0.254: v7.06,16.59 6.99,16.51 SI4464.3
  Bottom 0.254: C9.2 4.62,15.24 L2.1 5.9,15.34 v7.06,16.59 6.57,17.01 L4.2
N$34
  Top 0.254: 4.72,18.8 arc-90 L12.2
  Top 0.61: L12.2 5.41,18.42 5.14,18.14 C29.2 | C33.2 4.88,18.8 L12.2 | L11.1 7.06,19.13 6.43,19.13 6.43,19.12 5.84,18.53 L12.2
N$35
  Top 0.254: L13.1 3.61,21.53
  Top 0.406: 3.61,21.53 3.49,21.65 C31.2 3.67,22.3 C35.1
  Top 0.61: L13.1 2.52,21.17 ANT.2
N$36
  Top 0.254: R16.2 11.57,17.01 SPV1040.5 | R18.1 R16.2 | R16.2 11.59,16.27 12.06,15.8 12.06,15.3 C20.2
N$37
  Bottom 0.254: L4.1 7.74,18.71 | 7.74,18.71 C21.2 | 7.74,18.71 7.74,19.55 C22.1
N$38  (via drill 0.3)
  Top 0.254: U$3.8_VCC U$3.7_VCC_IO 39.77,12.22 v39.85,12.14
  Bottom 0.254: v39.85,12.14 40.65,12.14 | 40.65,12.14 Q1.2 | 40.65,12.14 40.65,12.15 41.51,13.02 41.51,13.54 SJ5.1
N$39
  Bottom 0.254: U$2.P$3 6.83,21.05 C22.2
N$40
  Top 0.254: 5.4,2.7 5.39,2.62
  Top 0.406: VPROG.1 2.14,3.02 2.54,2.62 3.5,2.62 | 3.5,2.62 5.39,2.62 U2.1 | 3.5,2.62 U2.3
N$41
  Top 0.254: SI4464.8 4.45,13.26 4.29,13.1 3.02,11.51 R9.2 C36.2
N$42
  Top 0.254: U2.4 3,1.16 C24.1
N$43  (via drill 0.3)
  Top 0.61: U$4.PP@2 44.77,7.81 v44.77,7.78
  Bottom 0.61: C25.1 46.04,11.11 arc90 44.77,9.84 v44.77,7.78
RADIO_IRQ  (via drill 0.3)
  Top 0.254: SI4464.11 5.46,11.26 v5.08,10.87 | U1.13 26.85,13.64 v26.67,13.5
  Bottom 0.254: v5.08,10.87 5.24,11.03 8.45,11.03 9.4,11.99 21.91,11.99 23.66,13.73 24.69,13.73 24.92,13.49 v26.67,13.5
RADIO_SDN  (via drill 0.3)
  Top 0.254: 28.62,14.68 U1.11 28.13,14.65 27.42,15.36 v27.42,15.78 | SI4464.1 7.99,15.61 v8.65,16.35 8.6,16.38 R10.2
  Bottom 0.254: v8.65,16.35 8.73,16.27 15.08,16.27 17.46,18.65 18.73,18.65 19.05,18.34 19.84,18.34 22.55,15.62 26.83,15.64 27.27,15.64 v27.42,15.78
RESET  (via drill 0.3)
  Top 0.203: U1.29 33.64,14.21 v34.77,14.21
  Top 0.254: R3.2 29.15,9.59 29.29,9.76 30,9.76 30.32,9.6 v30.72,9.6 | SPI.P$2 11.19,8.02 11.19,5 10.48,4.29 8.65,4.29 PROG.5
  Bottom 0.254: v34.77,14.21 34.61,14.21 33.81,13.41 33.81,12.86 30.72,9.76 v30.72,9.6 30.16,9.6 30,9.76 29.53,9.76 29.37,9.6 12.62,9.6 11.99,8.97 11.98,8.97 SPI.P$2
RXD  (via drill 0.3)
  Top 0.254: U1.30 34.26,14.65 34.92,15.32 v34.92,16.09
  Bottom 0.254: UART.P$2 43.18,22.37 43.18,21.51 41.12,19.45 40.25,19.45 38.51,17.7 36.89,17.7 36.58,17.38 36.04,17.38 34.92,16.27 v34.92,16.09 34.92,16.11 36.02,16.11 36.83,15.24 37.23,15.24 37.31,15.22 37.66,15.16 SJ1.2
SCK  (via drill 0.3)
  Top 0.254: 29.36,11.34 U1.17 28.89,11.43 v27.7,10.24 | v6.48,9.76 6.49,10.4 SI4464.12 | SPI.P$3 9.84,5.64 PROG.3 | v11.19,1.11 11.83,1.11 R13.1
  Bottom 0.254: 9.84,9.76 11.43,9.76 11.75,10.08 27.55,10.08 v27.7,10.24 | 9.84,9.76 v6.48,9.76 | SPI.P$3 9.84,9.76 | PROG.3 11.19,4.29 v11.19,1.11
SCL  (via drill 0.3)
  Top 0.203: U1.28 34.23,13.64 35.19,13.63 35.72,14.13 v35.72,15.22
  Top 0.254: BMP180.5 32.07,21.67 32.86,20.88 34.29,20.88 | 34.29,20.88 40.8,20.88 v42.86,18.81 | TCS4371FN.P$2 v45.4,20.88 | 34.29,20.88 R11.1
  Bottom 0.254: v35.72,15.22 36.49,14.42 36.51,13.26 39.85,13.26 40.17,13.58 40.17,15.01 42.55,17.38 42.55,18.49 v42.86,18.81 43.02,18.65 SJ4.1 44.29,18.7 44.29,20.08 45.09,20.88 v45.4,20.88
SDA  (via drill 0.3)
  Top 0.203: U1.27 34.5,13.13 v34.92,12.62
  Top 0.254: BMP180.6 31.11,19.35 R12.1 33.03,18.99 34.45,20.4 40.32,20.4 42.86,17.86 v43.18,17.86 43.5,18.18 43.5,19.29 42.91,19.88 TCS4371FN.P$6
  Bottom 0.254: v34.92,12.62 35.56,12.62 35.72,12.78 40.16,12.78 40.64,13.26 40.64,14.84 42.39,16.59 43.18,16.59 | 43.18,16.59 SJ3.1 | v43.18,17.86 43.18,16.59
SS  (via drill 0.3)
  Top 0.254: U1.14 27.7,13.1 26.99,12.7 26.04,12.7 25.85,12.57 v25.55,12.27 | SI4464.15 7.99,11.03 v9.37,11.03
  Bottom 0.254: v25.55,12.27 24.79,11.51 9.84,11.51 v9.37,11.03
TX_ENABLE  (via drill 0.3)
  Top 0.254: VCXO.2INNER VCXO.2 17.33,15.29 v16.5,15.29 | U1.12 27.68,14.14 v27.25,14.58
  Bottom 0.254: v27.25,14.58 27.14,14.68 22.07,14.68 19.37,17.38 18.89,17.38 16.8,15.29 v16.5,15.29
TXD  (via drill 0.3)
  Top 0.254: U1.31 34.11,15.13 34.29,15.32 34.29,18.97 34.62,19.3 v34.84,19.3 | v36.04,18.02 36.04,17.07 v36.35,16.75
  Bottom 0.254: UART.P$1 42.7,21.67 40.96,19.92 39.85,19.92 38.05,18.13 36.14,18.13 v36.04,18.02 34.84,19.21 v34.84,19.3 | SJ2.2 36.51,16.59 v36.35,16.75
VBAT  (via drill 0.3, 0.41)
  Top 0.254: TPS61200.8 TPS61200.7 TPS61200.6 | R6.1 41.04,22.2 v41.75,22.2 | R16.1 12.87,17.01 SPV1040.7 SPV1040.6
  Top 0.305: L3.P$1 21.75,18.34 22.7,18.34 | TPS61200.5 24.24,19.24 v23.81,18.81
  Top 0.406: TPS61200.6 27.19,17.91 26.45,17.16 C16.1 25.66,17.17 | 25.66,17.44 25.66,17.17 | 25.66,17.17 24.61,16.11 23.18,16.11 22.7,16.59 22.7,18.34 | 41.75,22.23 v41.75,22.2 47.01,22.2 VBAT.1 | v23.81,18.81 23.5,18.49 21.27,18.49 L3.P$1 | SPV1040.6 12.53,18.01 v13.02,18.49 | SPV1040.4 11.88,22.17 v11.75,21.99 | C15.1 v7.94,22.62
  Top 0.61: 21.75,18.49 21.75,18.34
  Bottom 0.254: 21.59,19.13 23.5,19.13
  Bottom 0.406: v41.75,22.2 41.75,22.94 arc90 41.27,23.42 30.8,23.42 29.69,22.3 24.45,22.3 23.81,21.67 v23.81,18.81 23.5,19.13 | 21.59,19.13 19.92,20.8 17.07,20.8 16.83,21.03 15.72,21.03 15.56,20.88 15.56,19.92 14.13,18.49 v13.02,18.49 13.02,18.81 10.95,20.88 10.95,21.51 | v11.75,21.99 11.43,21.99 10.95,21.51 | v7.94,22.62 9.84,22.62 10.95,21.51
VCC15  (via drill 0.3)
  Top 0.203: 38.77,13.26 37.78,13.26 37.62,13.41 36.35,13.41 36.2,13.26 36.2,11.63
  Top 0.254: VCXO.6INNER VCXO.6 | 19.05,22.15 19.05,16.82 v19.12,16.75 R22.1 | BMP180.3 33.2,22.46 | 33.2,22.46 BMP180.2 | U1.4 31.37,17.07 31.11,17.07 | 31.11,17.07 30.35,17.07 U1.6 30.35,19.1 29.69,19.76 29.69,22.46 | 29.69,22.46 33.2,22.46 | TPS61200.2 23.5,21.06 23.5,22.15 | 29.69,22.46 29.69,22.94 v29.37,23.26 R1.2 | 23.5,22.15 19.05,22.15 | 19.05,22.15 17.3,22.15 | 20.3,11.02 VCXO.6 | 20.48,11.31 arc-90 VCXO.6 | R12.2 31.11,17.07 | VCXO.6 20.32,11.16 20.32,12.03 v20.95,12.66 | 17.3,22.15 17.52,22.25 C12.1 17.3,22.94 17.3,22.15 | v23.5,22.46 23.5,22.15 | VCXO.6 20.16,10.22 20.15,10.24 | 3.15,12.98 3.13,13.06 3.33,13.26 v3.58,13.49 3.65,13.72 3.65,14.21 3.7,14.26 3.85,14.26 | 38.8,13.32 U$3.6_V_BCKP 38.77,13.26 42.07,13.26 | 37.22,10.47 LED2.A 35.99,11.47 R15.1 36.2,11.63 | 42.07,13.26 42.39,13.57 42.39,16.75 v41.59,17.54 41.59,17.86 40.01,19.45 35.79,19.45 v35.63,19.29 35.63,19.04 35.24,18.65 R20.2 | v36.51,22.33 35.98,22.86 C10.1 34.67,22.86 R11.2 34.27,22.46 33.2,22.46 | v45.4,20.08 45.26,20.23 TCS4371FN.P$1 | U1.18 29.87,10.9 29.61,10.64 29.05,10.64 27.38,8.97 | 27.38,8.97 22.23,8.97 22.07,9.13 | 22.07,9.13 20.95,10.24 20.15,10.24 | 17.3,22.15 C11.1 16.51,21.35 14.61,21.35 v11.11,17.86 | 20.15,10.24 19.53,10.24 18.89,9.6 13.81,9.6 13.65,9.76 12.7,9.76 12.38,9.45 SPI.P$1 | C38.2 22.07,9.13 | L7.1 3.61,14.41 | L7.1 3.7,14.27 3.71,14.26 | SI4464.6 3.85,14.26 | 3.85,14.26 L7.1 | 3.15,12.98 3.15,14.06 C8.1 1.29,14.03 | R9.1 2.38,12.92 3.15,12.98 | v42.07,12.14 42.07,13.26 | 27.38,8.97 27.38,9.03 R3.1 | PROG.2 11.19,1.75 8.73,1.75 7.94,0.93 C23.1 7.43,1.16
  Top 0.406: C6.2 2.7,12.88 R9.1 | 1.29,14.03 1.64,14.03 C2.1 | U2.5 7.43,1.16
  Bottom 0.254: v23.5,22.46 23.84,22.81 28.92,22.81 v29.37,23.26 | v20.95,12.66 20.8,12.82 20.8,15.07 v19.12,16.75 | v41.59,17.54 41.59,19.29 43.97,21.67 45.72,21.67 46.04,21.35 46.04,20.56 45.56,20.08 v45.4,20.08 | v36.51,22.33 36.51,20.17 v35.63,19.29 | SPI.P$1 12.38,7.54 13.73,6.19 13.73,4.29 PROG.2 | Q1.3 43.01,11.2 v42.07,12.14 43.07,13.14 SJ5.2 | v11.11,17.86 5.64,17.86 3.58,15.8 v3.58,13.49
VSOLAR  (via drill 0.3)
  Top 0.254: 10.48,20.35 C13.1
  Top 0.406: 10.48,20.35 9.76,21.06 L1.1 10.58,21.25 10.64,21.19 v12.06,21.19 | SPV1040.1 14.08,23.42 v14.45,23.42 15.08,23.42 VSOLAR.1 | SPV1040.8 13.83,19.27 v13.81,19.29
  Bottom 0.254: VSOLAR.1 16.19,22.78 17.07,23.65 19.21,23.65 19.21,22.95 R21.1
  Bottom 0.406: v12.06,21.19 13.49,21.19 | 13.49,21.19 13.49,22.62 v14.45,23.42 | v13.81,19.29 13.81,20.88 13.49,21.19

### Text on the board
tNames: + | - | 1 | Pecan Pico 5a v5 | ATMEGA328P-MU
tTest: UART | GND | Pecan 5a | GND
bTest: TXD | RXD | + | - | 2014-Sep-09